# EAGLE design Pedalboard Interface Shield v0.2 (EAGLE 7.2.0)
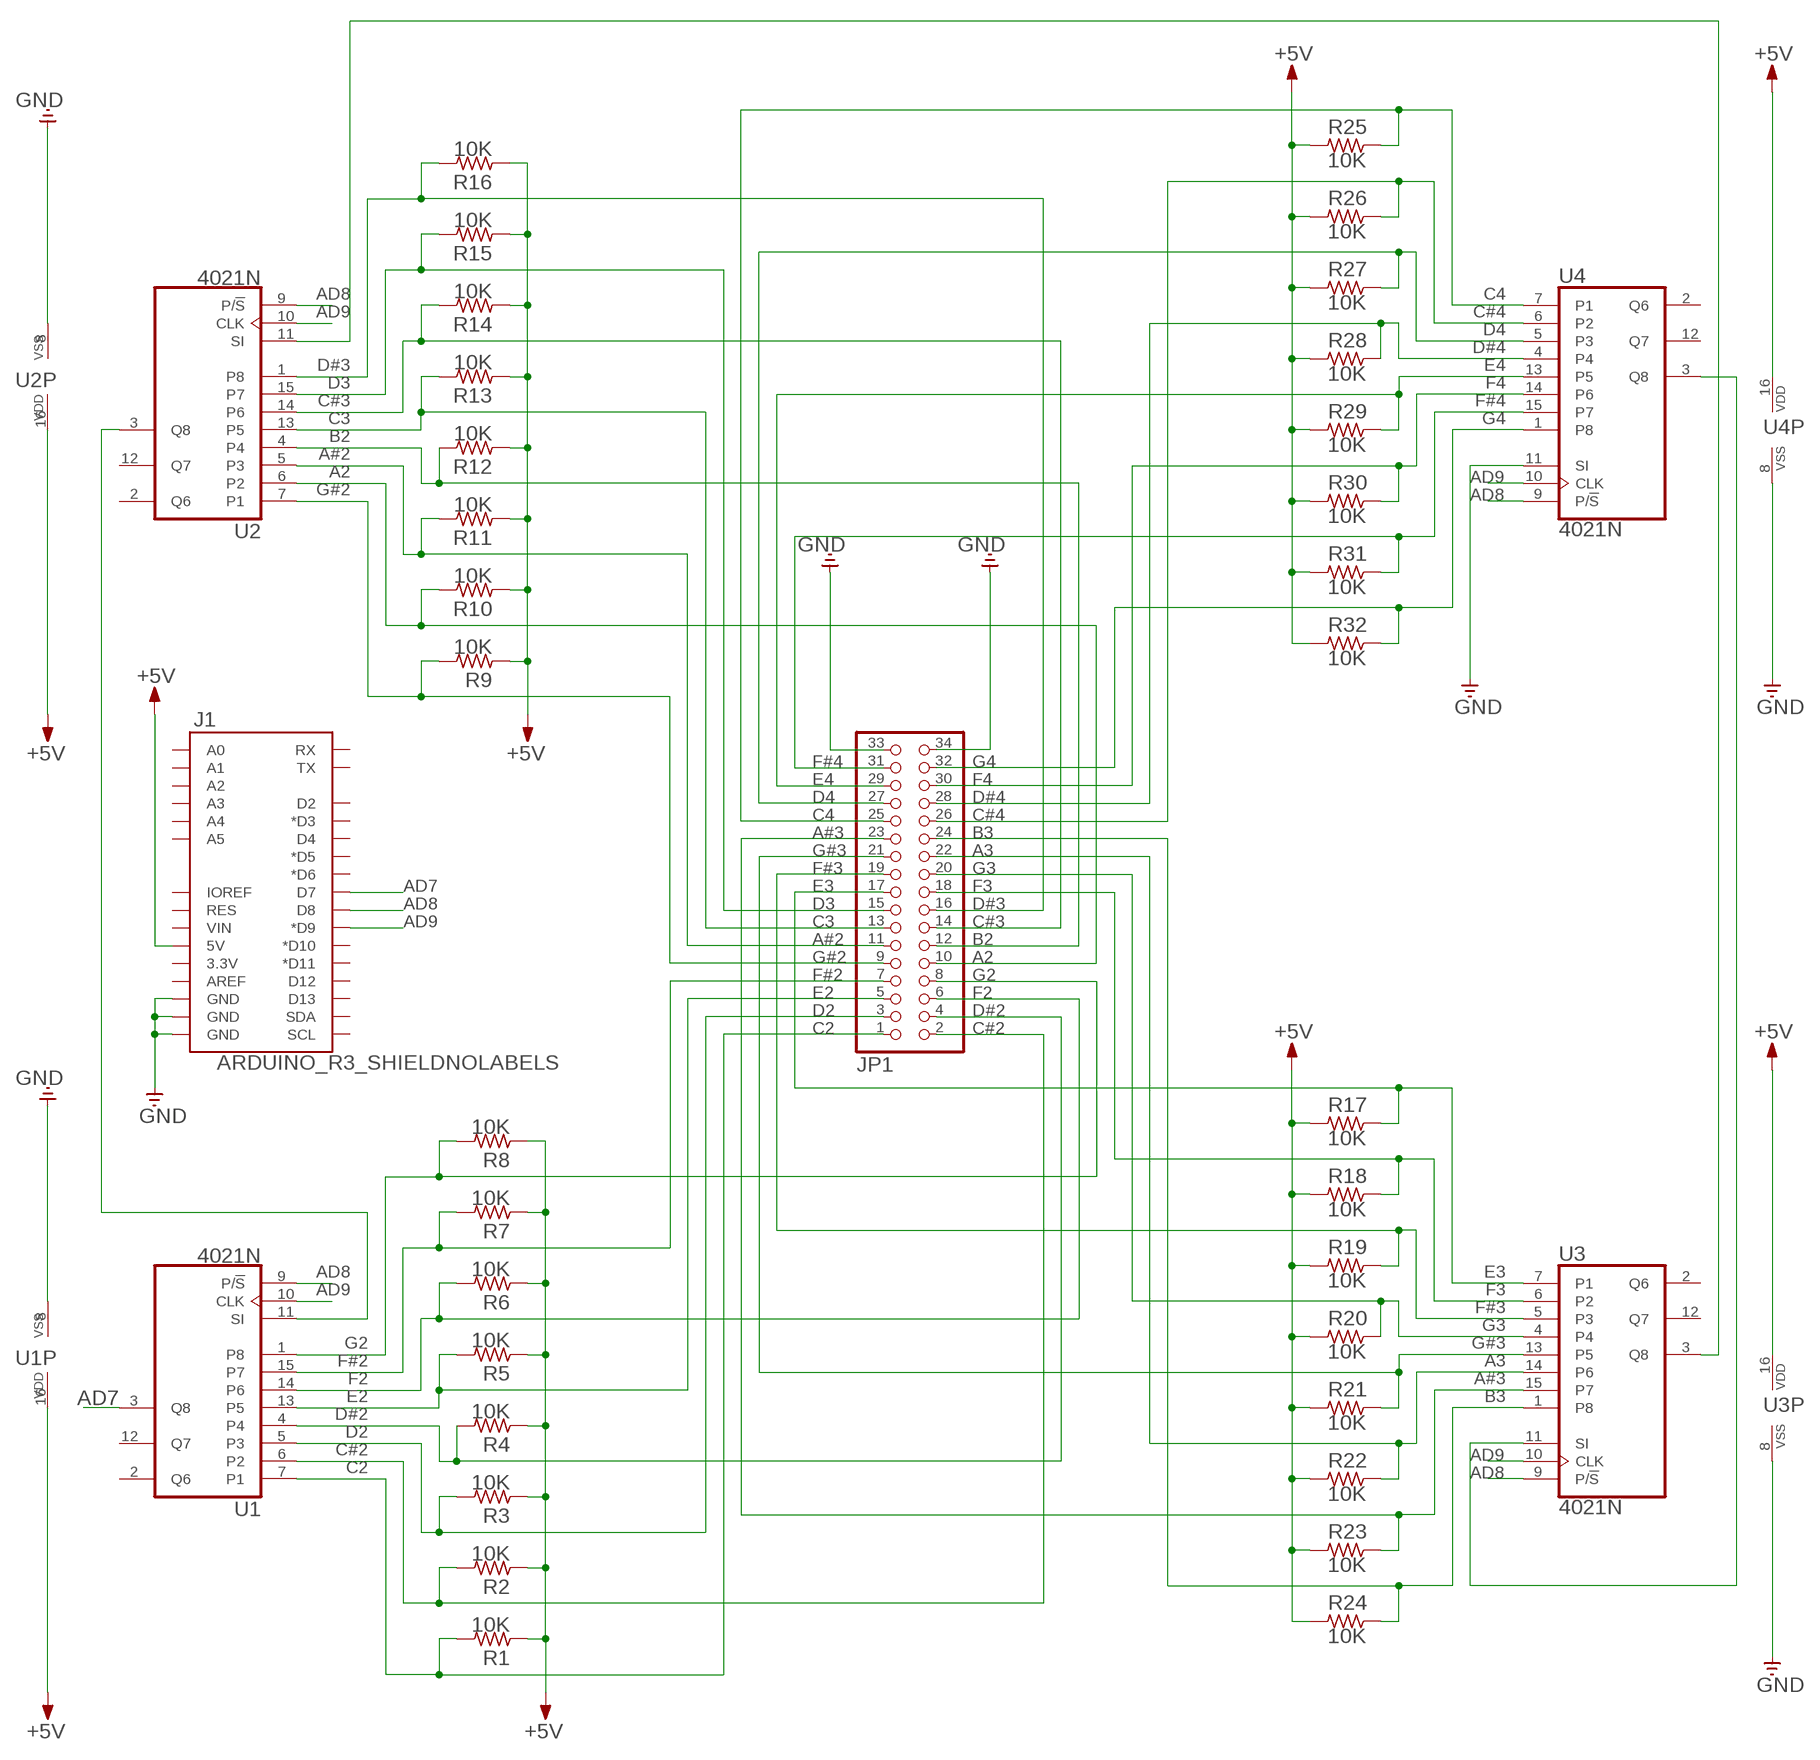
[diagram p0: schematic, sheet 1]

## Parts
J1  ARDUINO_R3_SHIELDNOLABELS  [UNO_R3_SHIELD_NOLABELS]
JP1  PINHD-2X17  [2X17]
R1  10K  R_X0207/2V  [0207/2V]
R2  10K  R_X0207/2V  [0207/2V]
R3  10K  R_X0207/2V  [0207/2V]
R4  10K  R_X0207/2V  [0207/2V]
R5  10K  R_X0207/2V  [0207/2V]
R6  10K  R_X0207/2V  [0207/2V]
R7  10K  R_X0207/2V  [0207/2V]
R8  10K  R_X0207/2V  [0207/2V]
R9  10K  R_X0207/2V  [0207/2V]
R10  10K  R_X0207/2V  [0207/2V]
R11  10K  R_X0207/2V  [0207/2V]
R12  10K  R_X0207/2V  [0207/2V]
R13  10K  R_X0207/2V  [0207/2V]
R14  10K  R_X0207/2V  [0207/2V]
R15  10K  R_X0207/2V  [0207/2V]
R16  10K  R_X0207/2V  [0207/2V]
R17  10K  R_X0207/2V  [0207/2V]
R18  10K  R_X0207/2V  [0207/2V]
R19  10K  R_X0207/2V  [0207/2V]
R20  10K  R_X0207/2V  [0207/2V]
R21  10K  R_X0207/2V  [0207/2V]
R22  10K  R_X0207/2V  [0207/2V]
R23  10K  R_X0207/2V  [0207/2V]
R24  10K  R_X0207/2V  [0207/2V]
R25  10K  R_X0207/2V  [0207/2V]
R26  10K  R_X0207/2V  [0207/2V]
R27  10K  R_X0207/2V  [0207/2V]
R28  10K  R_X0207/2V  [0207/2V]
R29  10K  R_X0207/2V  [0207/2V]
R30  10K  R_X0207/2V  [0207/2V]
R31  10K  R_X0207/2V  [0207/2V]
R32  10K  R_X0207/2V  [0207/2V]
U1  4021N  [DIL16]
U2  4021N  [DIL16]
U3  4021N  [DIL16]
U4  4021N  [DIL16]

## Nets
+5V: J1.5V R1.1 R2.1 R3.1 R4.1 R5.1 R6.1 R7.1 R8.1 R9.1 R10.1 R11.1 R12.1 R13.1 R14.1 R15.1 R16.1 R17.1 R18.1 R19.1 R20.1 R21.1 R22.1 R23.1 R24.1 R25.1 R26.1 R27.1 R28.1 R29.1 R30.1 R31.1 R32.1 U1.16(VDD) U2.16(VDD) U3.16(VDD) U4.16(VDD)
A2: JP1.10 R10.2 U2.6(P2)
A3: JP1.22 R22.2 U3.14(P6)
A#2: JP1.11 R11.2 U2.5(P3)
A#3: JP1.23 R23.2 U3.15(P7)
AD7: J1.D7 U1.3(Q8)
AD8: J1.D8 U1.9(P/!S) U2.9(P/!S) U3.9(P/!S) U4.9(P/!S)
AD9: J1.D9(*D9) U1.10(CLK) U2.10(CLK) U3.10(CLK) U4.10(CLK)
B2: JP1.12 R12.2 U2.4
B3: JP1.24 R24.2 U3.1(P8)
C2: JP1.1 R1.2 U1.7(P1)
C3: JP1.13 R13.2 U2.13(P5)
C4: JP1.25 R25.2 U4.7(P1)
C#2: JP1.2 R2.2 U1.6(P2)
C#3: JP1.14 R14.2 U2.14(P6)
C#4: JP1.26 R26.2 U4.6(P2)
D2: JP1.3 R3.2 U1.5(P3)
D3: JP1.15 R15.2 U2.15(P7)
D4: JP1.27 R27.2 U4.5(P3)
D#2: JP1.4 R4.2 U1.4
D#3: JP1.16 R16.2 U2.1(P8)
D#4: JP1.28 R28.2 U4.4
E2: JP1.5 R5.2 U1.13(P5)
E3: JP1.17 R17.2 U3.7(P1)
E4: JP1.29 R29.2 U4.13(P5)
F2: JP1.6 R6.2 U1.14(P6)
F3: JP1.18 R18.2 U3.6(P2)
F4: JP1.30 R30.2 U4.14(P6)
F#2: JP1.7 R7.2 U1.15(P7)
F#3: JP1.19 R19.2 U3.5(P3)
F#4: JP1.31 R31.2 U4.15(P7)
G2: JP1.8 R8.2 U1.1(P8)
G3: JP1.20 R20.2 U3.4
G4: JP1.32 R32.2 U4.1(P8)
G#2: JP1.9 R9.2 U2.7(P1)
G#3: JP1.21 R21.2 U3.13(P5)
GND: J1.GND@0(GND) J1.GND@1(GND) J1.GND@2(GND) JP1.33 JP1.34 U1.8(VSS) U2.8(VSS) U3.8(VSS) U4.8(VSS) U4.11(SI)
N$1: U2.11(SI) U3.3(Q8)
N$2: U3.11(SI) U4.3(Q8)
N$4: U1.11(SI) U2.3(Q8)
Unconnected: J1.3.3V J1.A0 J1.A1 J1.A2 J1.A3 J1.A4 J1.A5 J1.AREF J1.D2 J1.D3(*D3) J1.D4 J1.D5(*D5) J1.D6(*D6) J1.D10(*D10) J1.D11(*D11) J1.D12 J1.D13 J1.IOREF J1.RES J1.RX J1.SCL J1.SDA J1.TX J1.VIN U1.2(Q6) U1.12(Q7) U2.2(Q6) U2.12(Q7) U3.2(Q6) U3.12(Q7) U4.2(Q6) U4.12(Q7)

## Library data of the parts
J1 = SparkFun-Boards:ARDUINO_R3_SHIELD: Shield form compatible with the Arduino Uno R3.
JP1 = pinhead:PINHD-2X17: PIN HEADER
R1-R32 = rc-master:R_: RESISTOR
U1-U4 = 40xx:4021: 8-bit static SHIFT REGISTER

## Board
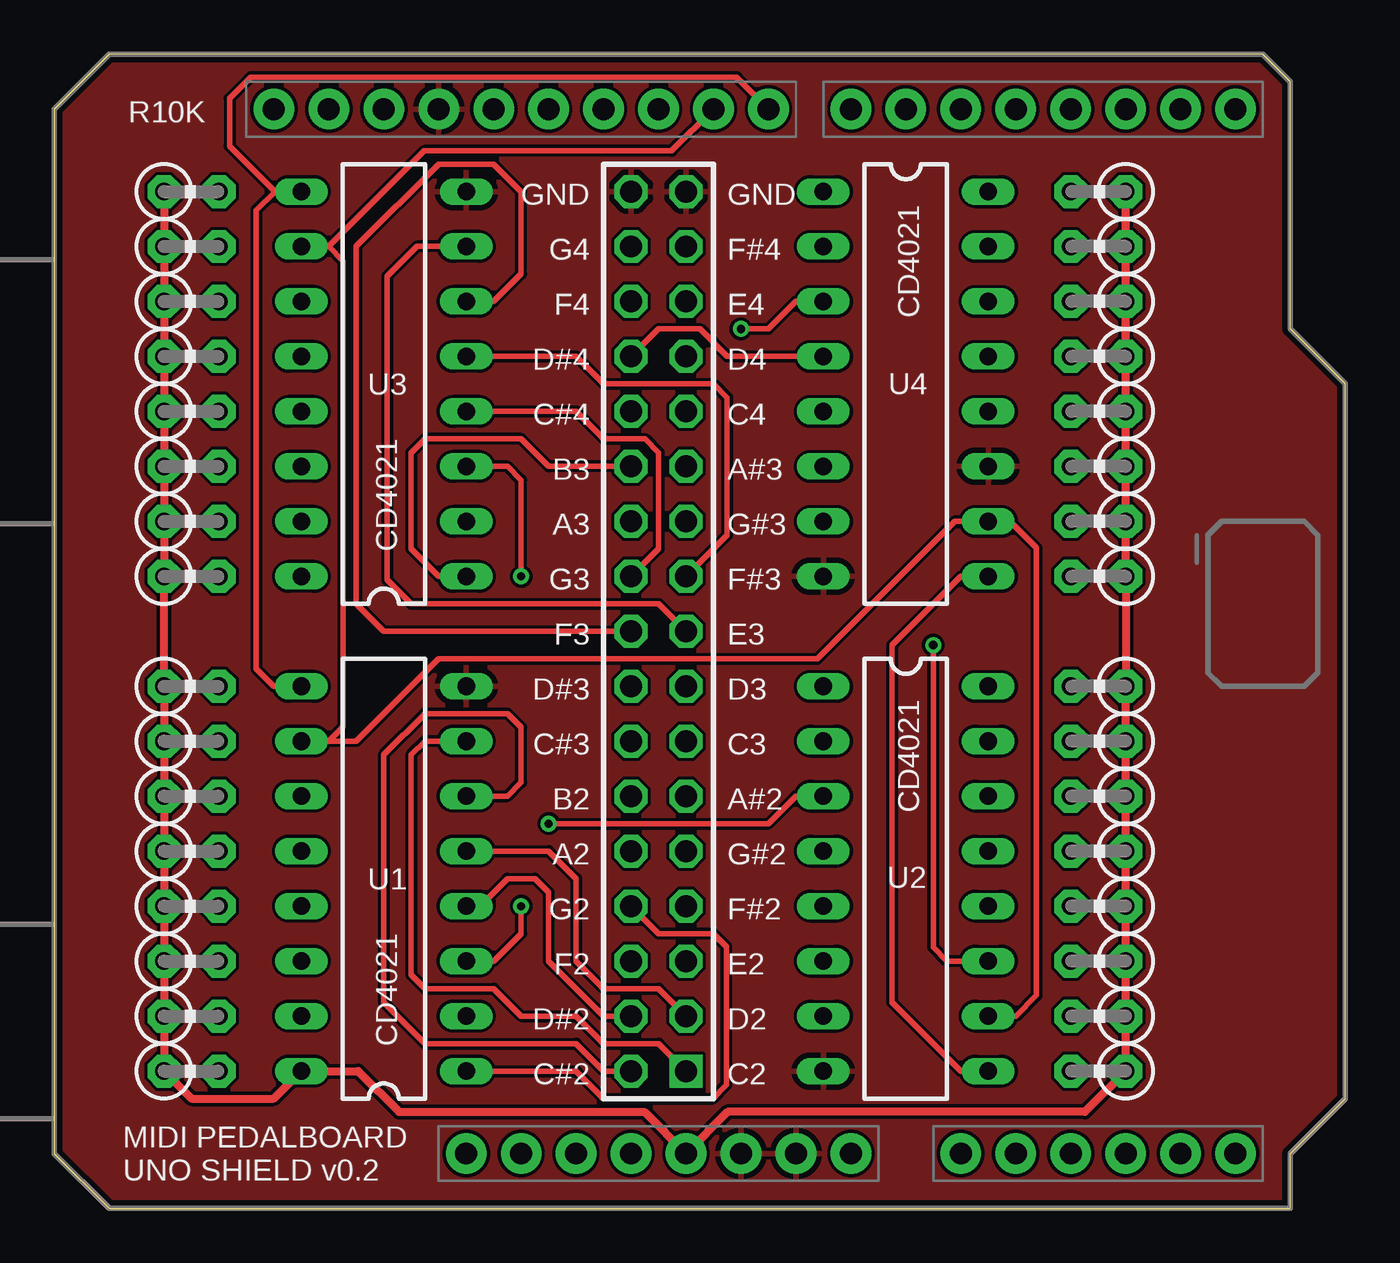
[diagram p1: board, top side]
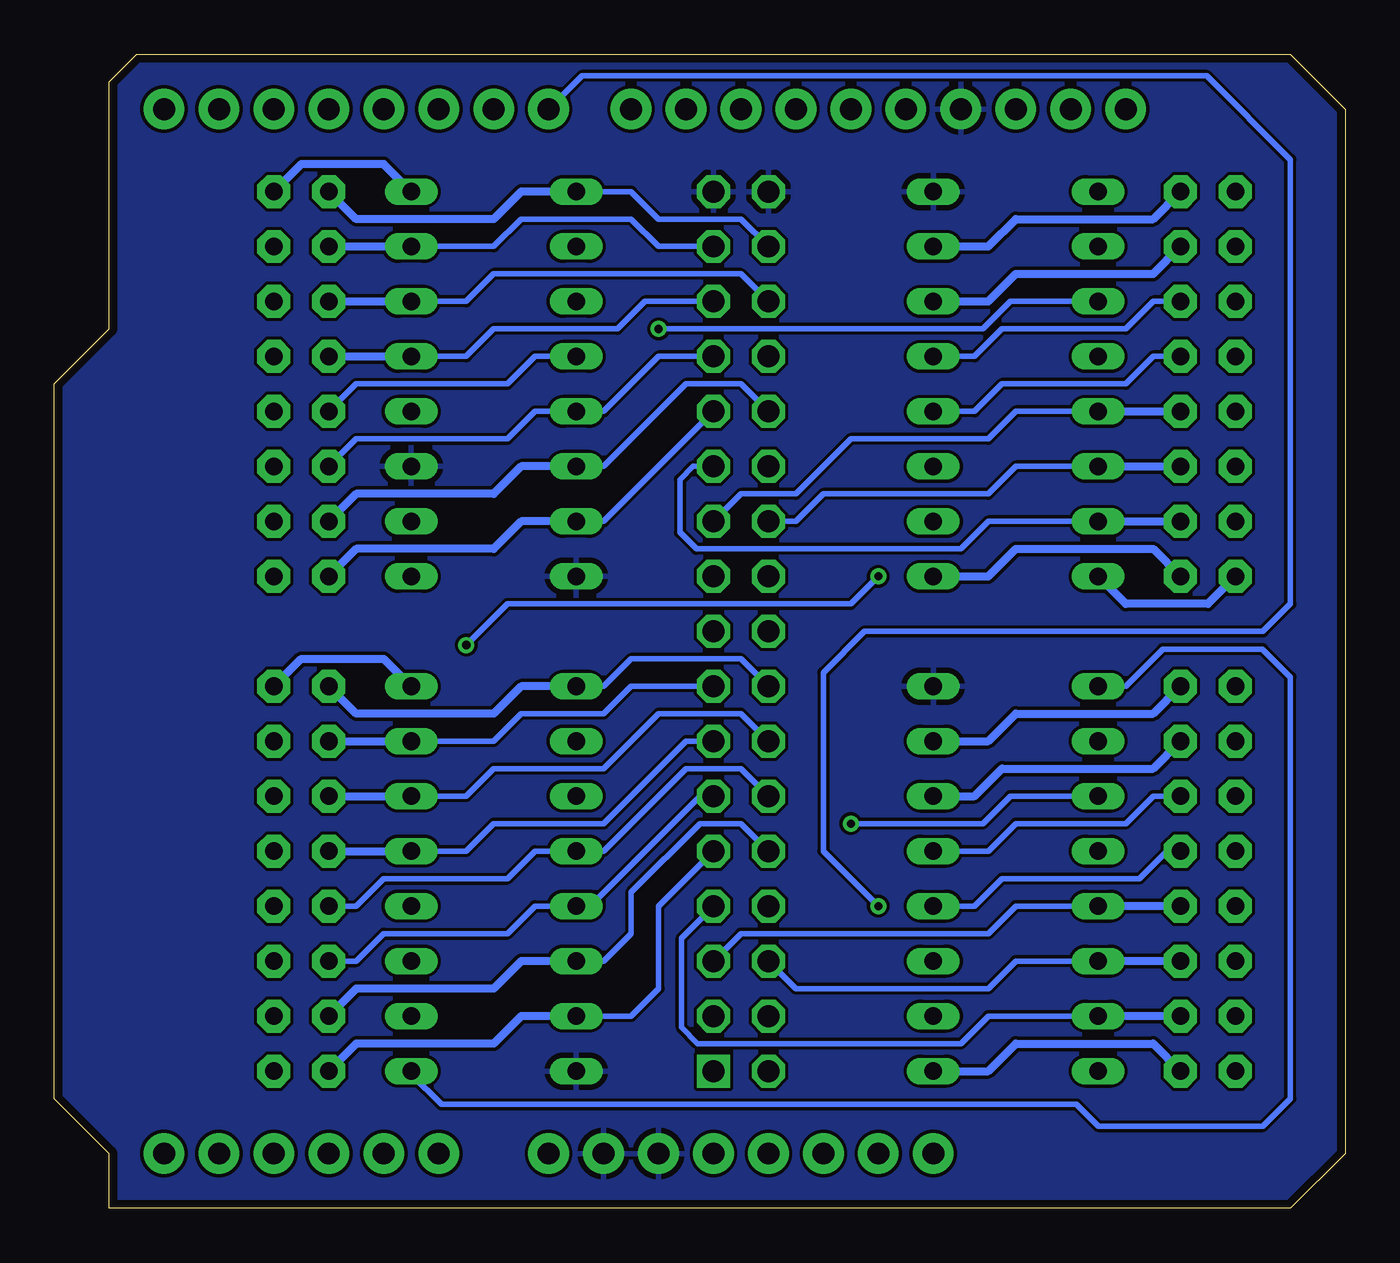
[diagram p2: board, bottom side, seen from below]

Size 59.69 x 53.34 mm. Coordinates in mm from the lower left corner, seen from the top.
Outline: 2.54,0 57.15,0 57.15,2.54 59.69,5.08 59.69,38.1 57.15,40.64 57.15,52.07 55.88,53.33 2.54,53.34 2.54,53.33 0,50.8 0,2.54 2.54,0
Copper layers (1*16): Top 0.0356mm / dielectric 1.5011mm / Bottom 0.0356mm
Design rules "LaenPCBOrder": minimum track width 6mil, minimum drill 13mil, track to track 6mil, track to pad 6mil, pad to pad 6mil, via to via 6mil, smd to smd 6mil, copper to edge 15mil, drill to drill 6mil, minimum pad ring 7mil, minimum via ring 7mil, stop-mask expansion 4mil, vias tented up to drill 0mil, thermal gap 10mil

### Footprints (pad centres in the part's own frame; a part is rotated, then mirrored left to right if it is on the bottom)
UNO_R3_SHIELD_NOLABELS = drill 1.016 pad 1.88: 3.3V 50.8,26.67; 5V 50.8,29.21; A0 50.8,41.91; A1 50.8,44.45; A2 50.8,46.99; A3 50.8,49.53; A4 50.8,52.07; A5 50.8,54.61; AREF 2.54,15.24; D2 2.54,49.53; D3 2.54,46.99; D4 2.54,44.45; D5 2.54,41.91; D6 2.54,39.37; D7 2.54,36.83; D8 2.54,33.02; D9 2.54,30.48; D10 2.54,27.94; D11 2.54,25.4; D12 2.54,22.86; D13 2.54,20.32; GND@0 50.8,31.75; GND@1 50.8,34.29; GND@2 2.54,17.78; IOREF 50.8,21.59; NC 50.8,19.05; RES 50.8,24.13; RX 2.54,54.61; SCL 2.54,10.16; SDA 2.54,12.7; TX 2.54,52.07; VIN 50.8,36.83
2X17 = drill 1.016 square: 1 -20.32,-1.27 | drill 1.016 octagon: 2 -20.32,1.27; 3 -17.78,-1.27; 4 -17.78,1.27; 5 -15.24,-1.27; 6 -15.24,1.27; 7 -12.7,-1.27; 8 -12.7,1.27; 9 -10.16,-1.27; 10 -10.16,1.27; 11 -7.62,-1.27; 12 -7.62,1.27; 13 -5.08,-1.27; 14 -5.08,1.27; 15 -2.54,-1.27; 16 -2.54,1.27; 17 0,-1.27; 18 0,1.27; 19 2.54,-1.27; 20 2.54,1.27; 21 5.08,-1.27; 22 5.08,1.27; 23 7.62,-1.27; 24 7.62,1.27; 25 10.16,-1.27; 26 10.16,1.27; 27 12.7,-1.27; 28 12.7,1.27; 29 15.24,-1.27; 30 15.24,1.27; 31 17.78,-1.27; 32 17.78,1.27; 33 20.32,-1.27; 34 20.32,1.27
0207/2V = drill 0.813 pad 1.524 octagon: 1 -1.27,0; 2 1.27,0
DIL16 = drill 0.813 long: 1 -8.89,-3.81; 2 -6.35,-3.81; 3 -3.81,-3.81; 4 -1.27,-3.81; 5 1.27,-3.81; 6 3.81,-3.81; 7 6.35,-3.81; 8 8.89,-3.81; 9 8.89,3.81; 10 6.35,3.81; 11 3.81,3.81; 12 1.27,3.81; 13 -1.27,3.81; 14 -3.81,3.81; 15 -6.35,3.81; 16 -8.89,3.81

### Placement (x,y rotation side)
J1  0,53.34 270 top
JP1  27.94,26.67 90 top
R1  6.35,24.13 0 top
R2  6.35,21.59 0 top
R3  6.35,19.05 0 top
R4  6.35,16.51 0 top
R5  6.35,13.97 0 top
R6  6.35,11.43 0 top
R7  6.35,8.89 0 top
R8  6.35,6.35 0 top
R9  48.26,6.35 180 top
R10  48.26,8.89 180 top
R11  48.26,11.43 180 top
R12  48.26,13.97 180 top
R13  48.26,16.51 180 top
R14  48.26,19.05 180 top
R15  48.26,21.59 180 top
R16  48.26,24.13 180 top
R17  6.35,46.99 0 top
R18  6.35,44.45 0 top
R19  6.35,41.91 0 top
R20  6.35,39.37 0 top
R21  6.35,36.83 0 top
R22  6.35,34.29 0 top
R23  6.35,31.75 0 top
R24  6.35,29.21 0 top
R25  48.26,29.21 180 top
R26  48.26,31.75 180 top
R27  48.26,34.29 180 top
R28  48.26,36.83 180 top
R29  48.26,39.37 180 top
R30  48.26,41.91 180 top
R31  48.26,44.45 180 top
R32  48.26,46.99 180 top
U1  15.24,15.24 90 top
U2  39.37,15.24 270 top
U3  15.24,38.1 90 top
U4  39.37,38.1 270 top

### Tracks (layer width: path | path; a pad name or v marks a point on that pad's centre or on a via)
+5V
  Top 0.381: R17.1 R18.1 R19.1 R20.1 R21.1 R22.1 R23.1 R24.1 R1.1 R2.1 R3.1 R4.1 R5.1 R6.1 R7.1 R8.1 6.35,5.08 10.16,5.08 U1.16 14.06,6.35 15.95,4.47 27.28,4.47 J1.5V 31.14,4.47 47.65,4.47 R9.1 R10.1 R11.1 R12.1 R13.1 R14.1 R15.1 R16.1 R25.1 R26.1 R27.1 R28.1 R29.1 R30.1 R31.1 R32.1
  Bottom 0.381: R16.1 48.26,25.4 44.45,25.4 U2.16 | R24.1 6.35,27.94 10.16,27.94 U3.16 | U4.16 44.45,48.26 48.26,48.26 R32.1
A2
  Bottom 0.254: U2.6 34.29,11.43 33.02,12.7 33.02,14.61 29.84,17.78 27.94,17.78 JP1.10
  Bottom 0.381: U2.6 38.1,11.43 39.37,10.16 45.72,10.16 R10.2
A3
  Bottom 0.254: U3.14 15.24,34.29 16.51,33.02 24.13,33.02 25.4,31.75 JP1.22
  Bottom 0.381: U3.14 R22.2
A#2
  Bottom 0.254: R11.2 45.72,11.43 44.45,12.7 38.73,12.7 37.47,13.97 U2.5 34.92,13.97 29.84,19.05 JP1.11
A#3
  Bottom 0.254: U3.15 16.51,31.75 17.78,30.48 30,30.48 30.76,31.23 30.76,33.68 30.15,34.29 JP1.23
  Bottom 0.381: U3.15 R23.2
AD7  (via drill 0.38)
  Top 0.254: U1.3 20.32,11.43 21.59,12.7 v21.59,13.97
  Bottom 0.254: J1.D7 35.29,52.34 6.42,52.34 2.54,48.46 2.54,27.94 3.81,26.67 22.23,26.67 24.13,24.77 24.13,16.51 v21.59,13.97
AD8
  Top 0.254: U2.9 41.91,6.35 38.73,9.53 38.73,26.04 41.91,29.21 U4.9 | U3.9 10.21,46.99 | 10.21,46.99 9.35,46.13 9.35,24.94 10.16,24.13 U1.9 | J1.D8 31.55,52.27 9.09,52.27 8.11,51.29 8.11,49.09 10.21,46.99
  Bottom 0.254: U2.9 43.18,6.21 41.78,4.82 12.44,4.82 11.43,3.81 3.81,3.81 2.54,5.08 2.54,24.55 3.83,25.84 8.45,25.84 10.16,24.13 U1.9
AD9
  Top 0.254: U2.10 44.45,8.89 45.41,9.85 45.41,30.52 44.18,31.75 U4.10 41.63,31.75 35.28,25.4 17.78,25.4 13.97,21.59 U1.10 12.7,21.59 13.37,22.26 13.37,43.77 12.69,44.45 | U3.10 12.69,44.45 | J1.D9 28.55,48.87 17.11,48.87 12.69,44.45
B2
  Bottom 0.254: R12.2 45.72,13.97 44.45,15.24 38.73,15.24 37.47,16.51 U2.4 34.29,16.51 30.48,20.32 27.94,20.32 JP1.12
B3
  Top 0.254: JP1.24 22.86,34.29 21.59,35.56 17.14,35.56 16.51,34.92 16.51,30.48 17.78,29.21 U3.1
  Bottom 0.381: U3.1 16.51,29.21 15.24,30.48 8.89,30.48 R24.2
C2
  Top 0.254: U1.7 17.14,21.59 16.51,20.95 16.51,10.79 17.14,10.16 20.32,10.16 21.59,8.89 24.13,8.89 25.4,7.62 27.94,7.62 JP1.1
  Bottom 0.381: U1.7 16.51,21.59 15.24,22.86 8.89,22.86 R1.2
C3
  Bottom 0.254: JP1.13 30.48,21.59 34.29,17.78 39.37,17.78 40.64,16.51 U2.13
  Bottom 0.381: R13.2 U2.13
C4
  Bottom 0.254: U4.7 34.29,31.75 JP1.25
  Bottom 0.381: U4.7 38.1,31.75 39.37,30.48 45.72,30.48 R25.2
C#2
  Top 0.254: U1.6 20.95,19.05 21.59,19.68 21.59,22.23 20.95,22.86 17.14,22.86 15.24,20.95 15.24,9.53 17.14,7.62 24.13,7.62 25.4,6.35 JP1.2
  Bottom 0.381: U1.6 17.14,19.05 15.88,20.32 8.89,20.32 R2.2
C#3
  Bottom 0.254: JP1.14 27.94,22.86 31.75,22.86 34.29,20.32 39.37,20.32 40.64,19.05 U2.14
  Bottom 0.381: R14.2 U2.14
C#4
  Bottom 0.254: U4.6 34.29,34.29 30.48,38.1 27.94,38.1 JP1.26
  Bottom 0.381: U4.6 38.1,34.29 39.37,33.02 45.72,33.02 R26.2
D2
  Top 0.254: U1.5 22.86,16.51 24.13,15.24 24.13,11.43 25.4,10.16 27.94,10.16 JP1.3
  Bottom 0.254: R3.2 8.89,19.05 10.16,17.78 15.24,17.78 16.51,16.51 U1.5
D3
  Bottom 0.254: JP1.15 33.02,24.13 34.29,22.86 38.1,22.86 39.37,21.59 U2.15
  Bottom 0.381: R15.2 U2.15
D4
  Bottom 0.254: JP1.27 31.75,39.37 34.29,36.83 U4.5 37.47,36.83 38.73,35.56 45.72,35.56 R27.2
D#2
  Top 0.254: U1.4 19.68,13.97 20.95,15.24 22.23,15.24 22.86,14.61 22.86,11.43 25.4,8.89 JP1.4
  Bottom 0.254: R4.2 8.26,16.51 9.53,15.24 15.88,15.24 17.14,13.97 U1.4
D#3
  Bottom 0.254: JP1.16 27.94,25.4 33.02,25.4 34.29,24.13 U2.1
  Bottom 0.381: U2.1 38.1,24.13 39.37,22.86 45.72,22.86 R16.2
D#4
  Top 0.254: JP1.28 27.94,40.64 29.84,40.64 31.11,39.37 U4.4
  Bottom 0.254: U4.4 37.47,39.37 38.73,38.1 45.72,38.1 R28.2
E2
  Bottom 0.254: U1.13 15.24,13.97 16.51,12.7 27.94,12.7 JP1.5
  Bottom 0.381: R5.2 U1.13
E3
  Top 0.254: U3.7 16.77,44.45 15.4,43.09 15.4,29.05 16.51,27.94 27.94,27.94 JP1.17
  Bottom 0.381: U3.7 16.51,44.45 15.24,45.72 8.89,45.72 R17.2
E4
  Bottom 0.254: JP1.29 32.38,41.91 33.66,40.64 39.37,40.64 40.64,39.37 U4.13
  Bottom 0.381: R29.2 U4.13
F2
  Bottom 0.254: U1.14 15.24,11.43 16.51,10.16 25.4,10.16 JP1.6
  Bottom 0.381: R6.2 U1.14
F3
  Top 0.254: U3.6 20.32,41.91 21.59,43.18 21.59,46.99 20.32,48.26 17.78,48.26 13.97,44.45 13.97,27.94 15.24,26.67 JP1.18
  Bottom 0.381: U3.6 16.51,41.91 15.24,43.18 8.89,43.18 R18.2
F4
  Bottom 0.254: JP1.30 27.94,43.18 39.37,43.18 40.64,41.91 U4.14
  Bottom 0.381: R30.2 U4.14
F#2
  Bottom 0.254: U1.15 16.51,8.89 17.78,7.62 29.94,7.62 30.69,8.37 30.69,12.49 JP1.7
  Bottom 0.381: R7.2 U1.15
F#3
  Top 0.254: U3.5 24.13,39.37 25.4,38.1 30.48,38.1 31.11,37.47 31.11,31.11 JP1.19
  Bottom 0.254: R19.2 8.89,41.91 10.16,40.64 15.88,40.64 17.14,39.37 U3.5
F#4
  Bottom 0.254: JP1.31 31.75,44.45 33.02,45.72 38.1,45.72 39.37,44.45 U4.15
  Bottom 0.381: R31.2 U4.15
G2
  Top 0.254: U1.1 24.13,6.35 25.4,5.08 30.45,5.08 31.08,5.71 31.08,12.1 30.48,12.7 27.94,12.7 JP1.8
  Bottom 0.381: U1.1 16.51,6.35 15.24,7.62 8.89,7.62 R8.2
G3
  Top 0.254: U3.4 24.13,36.83 25.4,35.56 27.3,35.56 27.94,34.92 27.94,30.48 JP1.20
  Bottom 0.254: R20.2 8.89,39.37 10.16,38.1 15.88,38.1 17.14,36.83 U3.4
G4
  Bottom 0.254: JP1.32 27.94,45.72 31.75,45.72 33.02,46.99 U4.1
  Bottom 0.381: U4.1 38.1,46.99 39.37,45.72 45.72,45.72 R32.2
G#2
  Bottom 0.254: U2.7 33.02,8.89 31.75,10.16 31.75,13.97 JP1.9
  Bottom 0.381: U2.7 38.1,8.89 39.37,7.62 45.72,7.62 R9.2
G#3
  Bottom 0.254: U3.13 15.24,36.83 16.51,35.56 22.86,35.56 25.4,33.02 27.94,33.02 JP1.21
  Bottom 0.381: U3.13 R21.2
GND
  pour Top: -1.27,-1.27 62.23,-1.27 62.23,54.61 -1.27,54.61
  pour Bottom: -2.54,-2.54 63.5,-2.54 63.5,55.88 -2.54,55.88
N$1  (via drill 0.38)
  Top 0.254: U2.11 41.27,11.43 40.64,12.06 v40.64,26.04 | v21.59,29.21 21.59,33.66 20.95,34.29 U3.3
  Bottom 0.254: v40.64,26.04 38.73,27.94 22.86,27.94 v21.59,29.21
N$2  (via drill 0.38)
  Top 0.254: v31.75,40.64 33.02,40.64 34.29,41.91 U4.3
  Bottom 0.254: U3.11 15.49,41.91 16.76,40.64 v31.75,40.64
N$4  (via drill 0.38)
  Top 0.254: v22.86,17.78 33.02,17.78 34.29,19.05 U2.3
  Bottom 0.254: U1.11 15.49,19.05 16.76,17.78 v22.86,17.78

### Text on the board
tPlace: R10K | GND | GND | CD4021 | G4 | F#4 | F4 | E4 | D#4 | D4 | CD4021 | C#4 | C4 | B3 | A#3 | A3 | G#3 | G3 | F#3 | F3 | E3 | D#3 | D3 | CD4021 | C#3 | C3 | B2 | A#2 | A2 | G#2 | CD4021 | G2 | F#2 | F2 | E2 | D#2 | D2 | C#2 | C2 | MIDI PEDALBOARD / UNO SHIELD v0.2